# EAGLE schematic shieldV4 (EAGLE 8.7.1)

## Sheet 1 of 6
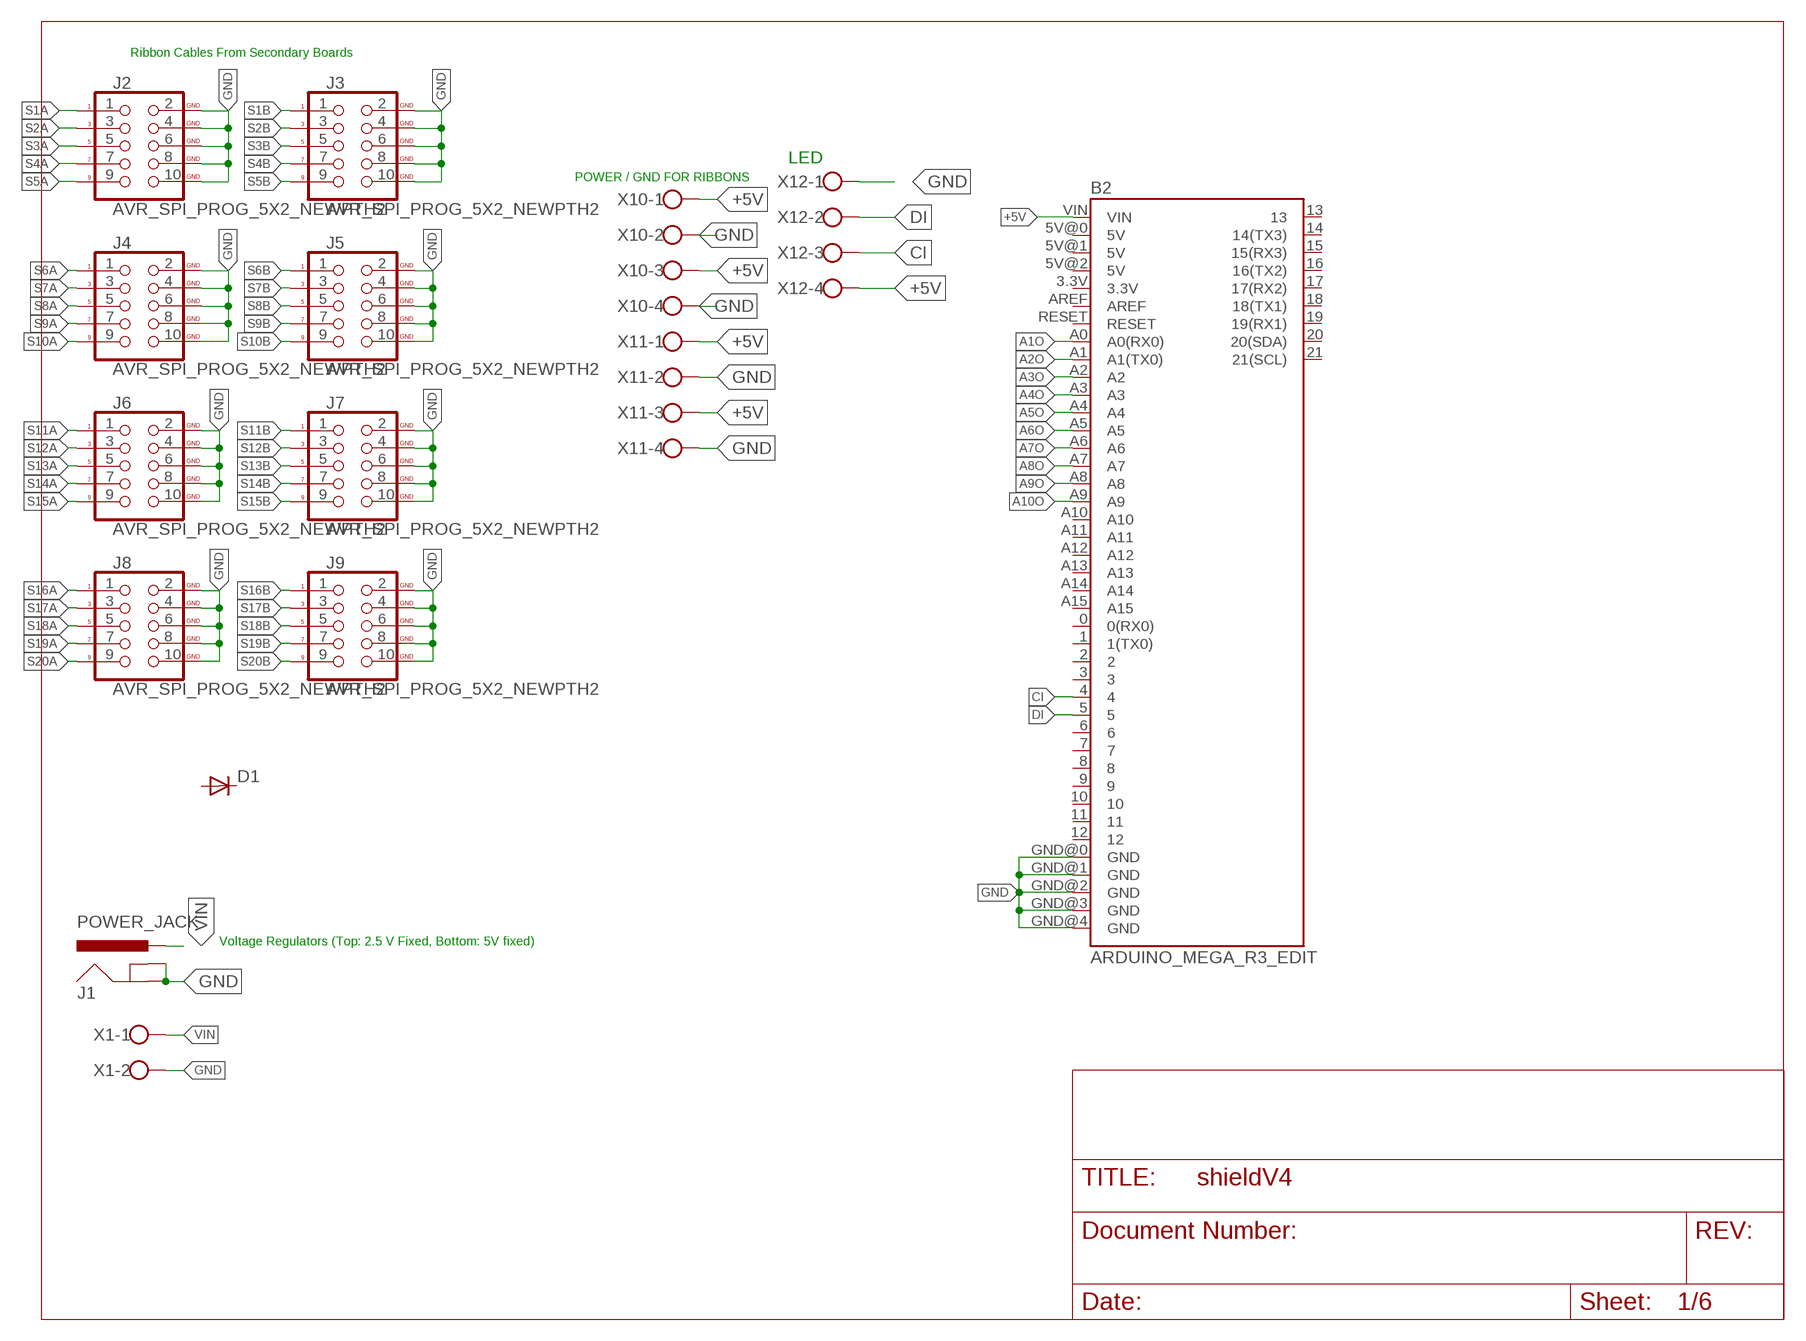
[diagram p0: schematic, sheet 1, part 1 of 2]
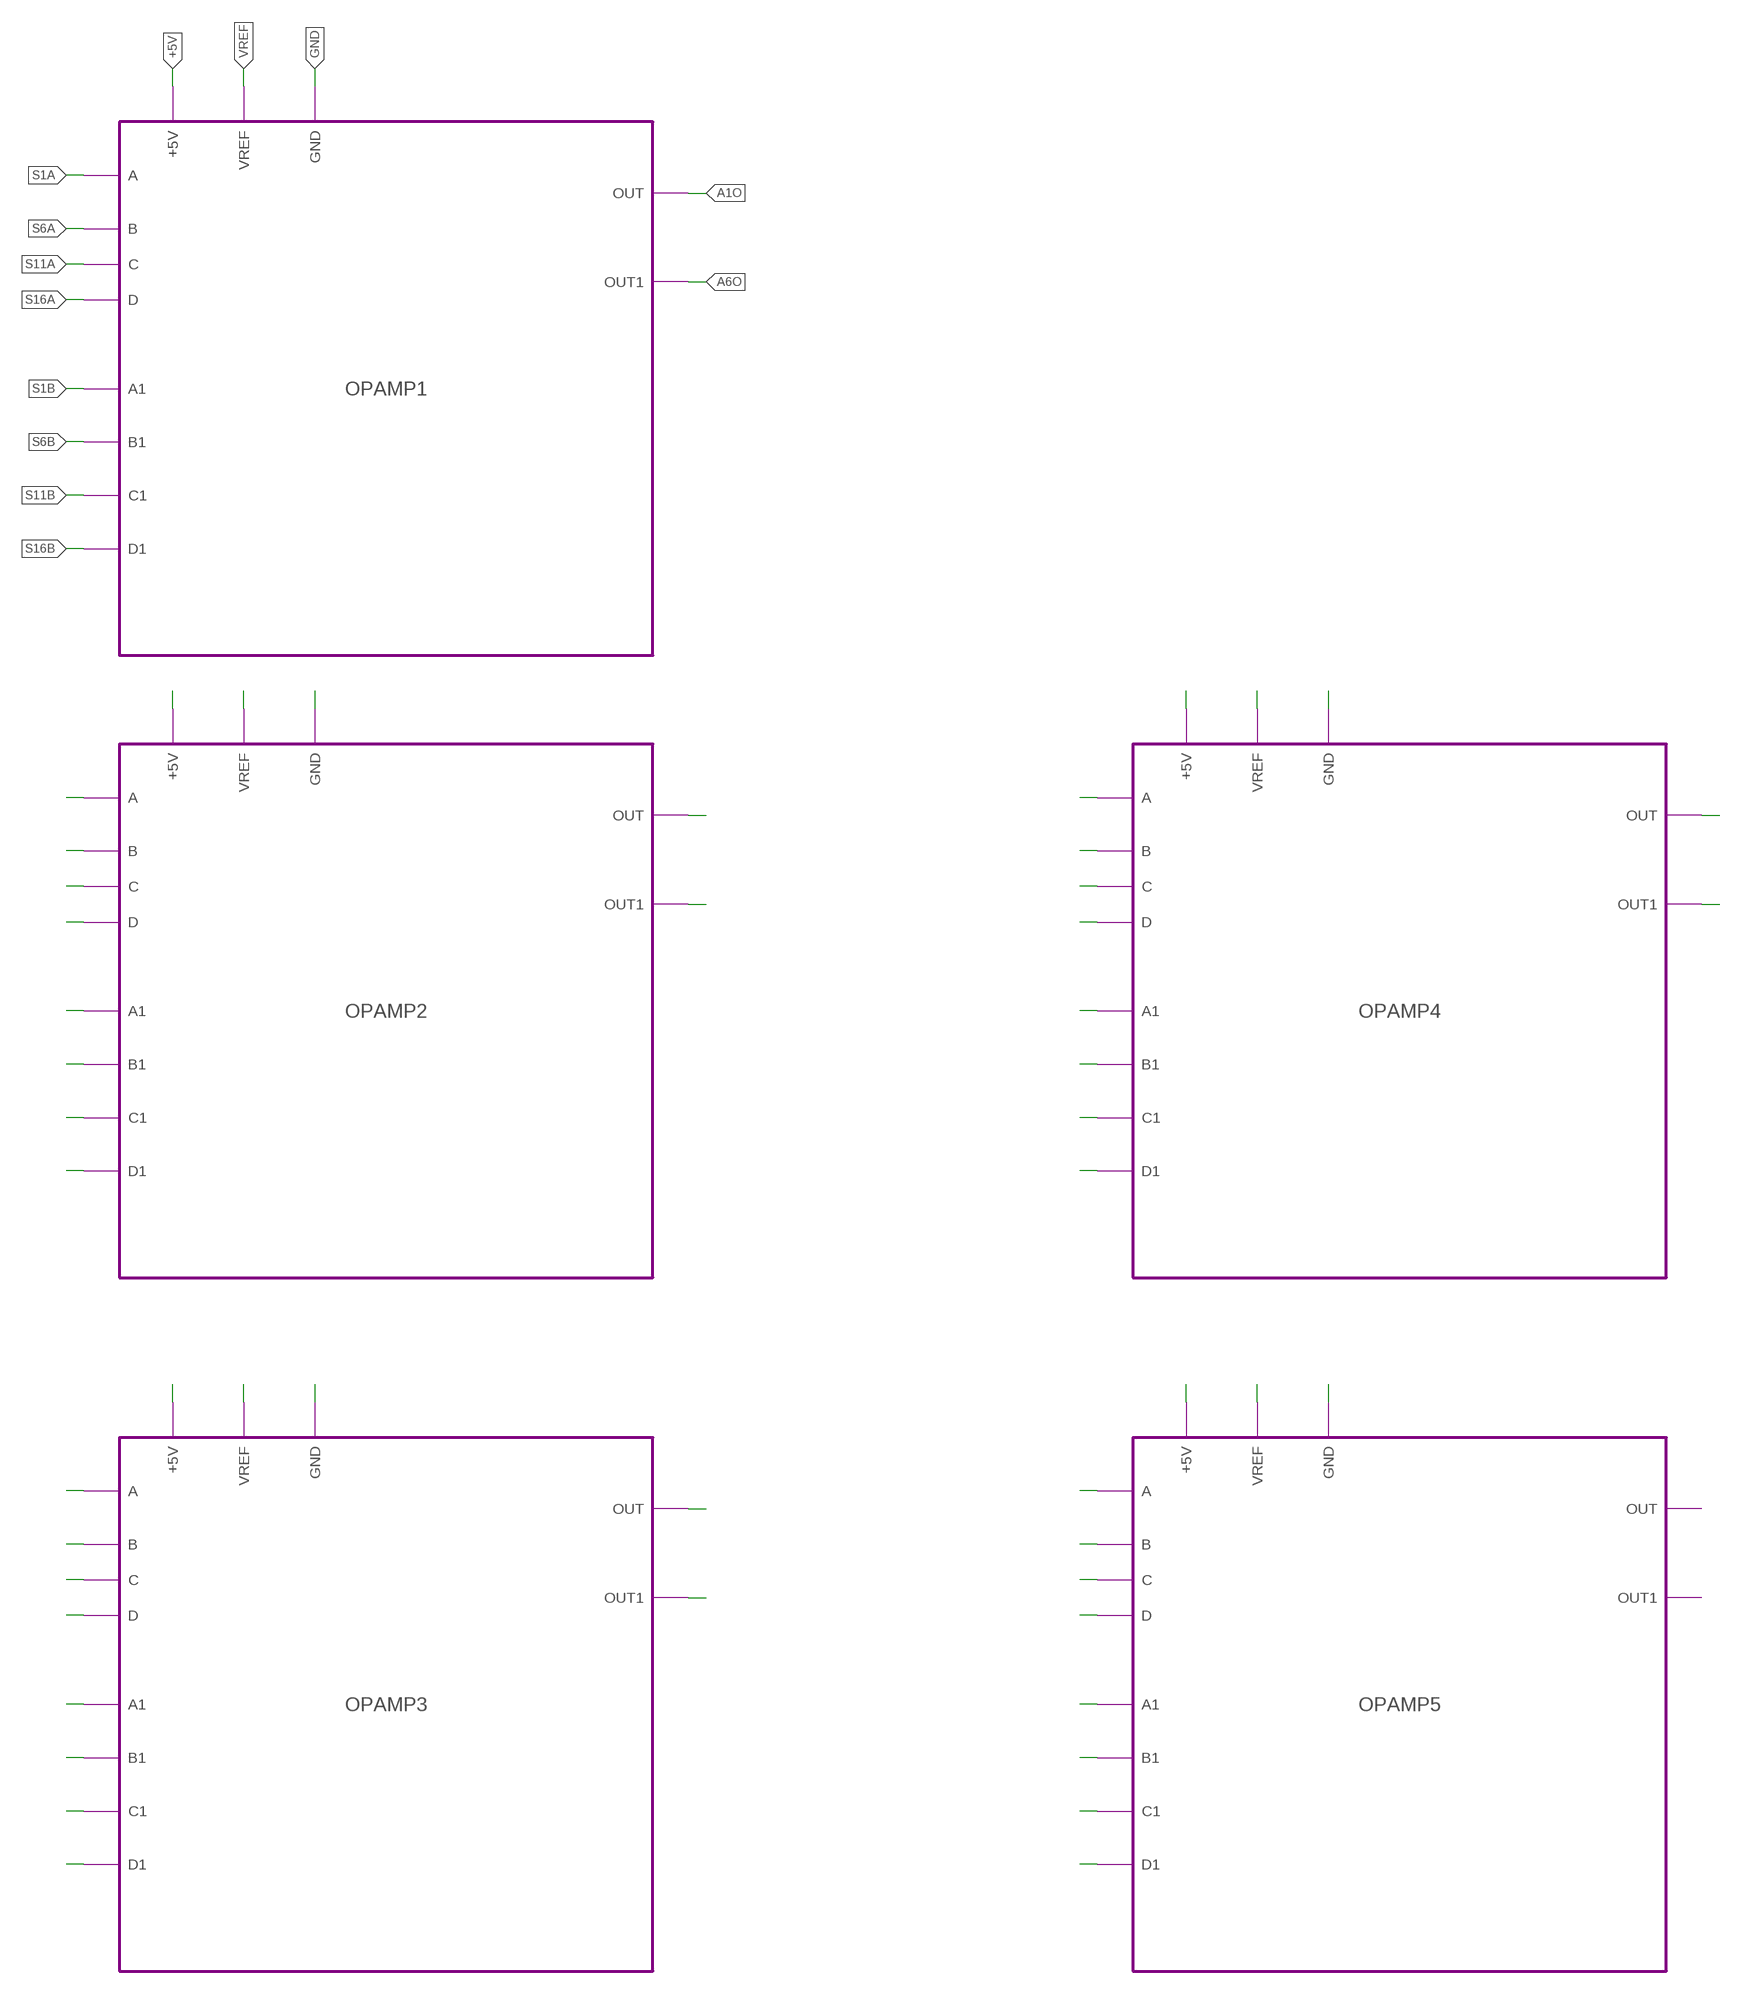
[diagram p1: schematic, sheet 1, part 2 of 2]

### Parts
B2  ARDUINO_MEGA_R3_EDIT  [ARDUINO_MEGA_EDIT]
D1  DIODE-DO-214AC  [DO-214AC]
J1  POWER_JACK  [POWER_JACK_PTH]
J2  AVR_SPI_PROG_5X2_NEWPTH2  [2X5-SHROUDED]
J3  AVR_SPI_PROG_5X2_NEWPTH2  [2X5-SHROUDED]
J4  AVR_SPI_PROG_5X2_NEWPTH2  [2X5-SHROUDED]
J5  AVR_SPI_PROG_5X2_NEWPTH2  [2X5-SHROUDED]
J6  AVR_SPI_PROG_5X2_NEWPTH2  [2X5-SHROUDED]
J7  AVR_SPI_PROG_5X2_NEWPTH2  [2X5-SHROUDED]
J8  AVR_SPI_PROG_5X2_NEWPTH2  [2X5-SHROUDED]
J9  AVR_SPI_PROG_5X2_NEWPTH2  [2X5-SHROUDED]
X1  W237-102  [W237-102]
X10  W237-4  [W237-4]
X11  W237-4  [W237-4]
X12  W237-4  [W237-4]

### Module instances
OPAMP1 = OPAMP
OPAMP2 = OPAMP
OPAMP3 = OPAMP
OPAMP4 = OPAMP
OPAMP5 = OPAMP

### Nets
+5V: B2.VIN X10.1 X10.3 X11.1 X11.3 X12.4 ; port OPAMP1.+5V
A1O: B2.A0(A0(RX0)) ; port OPAMP1.OUT
A2O: B2.A1(A1(TX0))
A3O: B2.A2
A4O: B2.A3
A5O: B2.A4
A6O: B2.A5 ; port OPAMP1.OUT1
A7O: B2.A6
A8O: B2.A7
A9O: B2.A8
A10O: B2.A9
CI: B2.4 X12.3
DI: B2.5 X12.2
GND: B2.GND@0(GND) B2.GND@1(GND) B2.GND@2(GND) B2.GND@3(GND) B2.GND@4(GND) J1.GND J1.GNDBREAK J2.2(GND) J2.4(GND) J2.6(GND) J2.8(GND) J2.10(GND) J3.2(GND) J3.4(GND) J3.6(GND) J3.8(GND) J3.10(GND) J4.2(GND) J4.4(GND) J4.6(GND) J4.8(GND) J4.10(GND) J5.2(GND) J5.4(GND) J5.6(GND) J5.8(GND) J5.10(GND) J6.2(GND) J6.4(GND) J6.6(GND) J6.8(GND) J6.10(GND) J7.2(GND) J7.4(GND) J7.6(GND) J7.8(GND) J7.10(GND) J8.2(GND) J8.4(GND) J8.6(GND) J8.8(GND) J8.10(GND) J9.2(GND) J9.4(GND) J9.6(GND) J9.8(GND) J9.10(GND) X1.2 X10.2 X10.4 X11.2 X11.4 X12.1 ; port OPAMP1.GND
N$14: port OPAMP2.A
N$15: port OPAMP2.B
N$16: port OPAMP2.C
N$17: port OPAMP2.D
N$18: port OPAMP2.A1
N$19: port OPAMP2.B1
N$20: port OPAMP2.C1
N$21: port OPAMP2.D1
N$22: port OPAMP2.+5V
N$23: port OPAMP2.VREF
N$24: port OPAMP2.GND
N$25: port OPAMP2.OUT
N$26: port OPAMP2.OUT1
N$27: port OPAMP3.A
N$28: port OPAMP3.B
N$29: port OPAMP3.C
N$30: port OPAMP3.D
N$31: port OPAMP3.A1
N$32: port OPAMP3.B1
N$33: port OPAMP3.C1
N$34: port OPAMP3.D1
N$35: port OPAMP3.+5V
N$36: port OPAMP3.VREF
N$37: port OPAMP3.GND
N$38: port OPAMP3.OUT
N$39: port OPAMP3.OUT1
N$40: port OPAMP4.A
N$41: port OPAMP4.B
N$42: port OPAMP4.C
N$43: port OPAMP4.D
N$44: port OPAMP4.A1
N$45: port OPAMP4.B1
N$46: port OPAMP4.C1
N$47: port OPAMP4.D1
N$48: port OPAMP4.+5V
N$49: port OPAMP4.VREF
N$50: port OPAMP4.GND
N$51: port OPAMP4.OUT
N$52: port OPAMP4.OUT1
N$53: port OPAMP5.A
N$54: port OPAMP5.B
N$55: port OPAMP5.C
N$56: port OPAMP5.D
N$57: port OPAMP5.A1
N$58: port OPAMP5.B1
N$59: port OPAMP5.C1
N$60: port OPAMP5.D1
N$61: port OPAMP5.+5V
N$62: port OPAMP5.VREF
N$63: port OPAMP5.GND
N$64: port OPAMP5.OUT ; also sheet 6
N$65: port OPAMP5.OUT1 ; also sheet 6
S1A: J2.1 ; port OPAMP1.A
S1B: J3.1 ; port OPAMP1.A1
S2A: J2.3
S2B: J3.3
S3A: J2.5
S3B: J3.5
S4A: J2.7
S4B: J3.7
S5A: J2.9
S5B: J3.9
S6A: J4.1 ; port OPAMP1.B
S6B: J5.1 ; port OPAMP1.B1
S7A: J4.3
S7B: J5.3
S8A: J4.5
S8B: J5.5
S9A: J4.7
S9B: J5.7
S10A: J4.9
S10B: J5.9
S11A: J6.1 ; port OPAMP1.C
S11B: J7.1 ; port OPAMP1.C1
S12A: J6.3
S12B: J7.3
S13A: J6.5
S13B: J7.5
S14A: J6.7
S14B: J7.7
S15A: J6.9
S15B: J7.9
S16A: J8.1 ; port OPAMP1.D
S16B: J9.1 ; port OPAMP1.D1
S17A: J8.3
S17B: J9.3
S18A: J8.5
S18B: J9.5
S19A: J8.7
S19B: J9.7
S20A: J8.9
S20B: J9.9
VIN: J1.PWR X1.1
VREF: port OPAMP1.VREF
Unconnected: B2.0(0(RX0)) B2.1(1(TX0)) B2.2 B2.3 B2.3.3V B2.5V@0(5V) B2.5V@1(5V) B2.5V@2(5V) B2.6 B2.7 B2.8 B2.9 B2.10 B2.11 B2.12 B2.13 B2.14(14(TX3)) B2.15(15(RX3)) B2.16(16(TX2)) B2.17(17(RX2)) B2.18(18(TX1)) B2.19(19(RX1)) B2.20(20(SDA)) B2.21(21(SCL)) B2.A10 B2.A11 B2.A12 B2.A13 B2.A14 B2.A15 B2.AREF B2.RESET D1.A D1.C

### Notes on the sheet
- Ribbon Cables From Secondary Boards
- LED
- POWER / GND FOR RIBBONS
- Voltage Regulators (Top: 2.5 V Fixed, Bottom: 5V fixed)

## Sheet 2 of 6

## Sheet 3 of 6

## Sheet 4 of 6

## Sheet 5 of 6

## Sheet 6 of 6
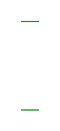
[diagram p2: schematic, sheet 6]

## Library data of the parts
B2 = SparkFun-Boards:ARDUINO_MEGA_R3_EDIT: Arduino Mega R3 ATmega2560 R3 compatible footprint. SparkFun Products: Arduino Mega 2560 R3 <https://www.sparkfun.com/products/11061>
D1 = diode:DIODE-: DIODE
J1 = SparkFun-Connectors:POWER_JACK: Power Jack Connector This is the standard 5.5mm barrel jack for power. The PTH is the most common, proven, reliable, footprint. The Slot footprint only works if the mill layer is transmitted to the PCB fab house so be warned. Here are the connectors we sell at SparkFun: DC Barrel Power Jack/Connector <https://www.sparkfun.com/products/119> (PRT-00119) DC Barrel Power Jack/Connector (SMD) <https://www.sparkfun.com/products/12748> (PRT-12748) DC Barrel Jack Adapter - Breadboard Compatible <https://www.sparkfun.com/products/10811> (PRT-10811) It is used on this SparkFun product (and many, many others): SparkFun RedBoard - Programmed with Arduino <https://www.sparkfun.com/products/12757> (DEV-12757) Also, if you need a mating power supply or connector, please check these out: Wall Adapter Power Supply - 9VDC 650mA <https://www.sparkfun.com/products/298> (TOL-00298) DC Barrel Jack Adapter - Male <https://www.sparkfun.com/products/10287> (PRT-10287); PROD_ID: CONN-08197
J2-J9 = SparkFun-Connectors:AVR_SPI_PROG_5X2_NEW: AVR 10-pin ICSP Header This is the standard AVR In Circuit Serial Programming header. Minimal, but includes pin one indicator. Works with standard Olimex programmers. SparkFun Products: 2x5 AVR ICSP Male Header <https://www.sparkfun.com/products/778> - PTH 2x5 Pin Shrouded Header <https://www.sparkfun.com/products/8506> - PTH2; PROD_ID: CONN-08671; SF_ID: PRT-08506
X1 = con-wago-500:W237-102: WAGO SCREW CLAMP; MPN: 237-102; OC_FARNELL: unknown; OC_NEWARK: 70K9898
X10-X12 = con-wago-500:W237-4: WAGO SCREW CLAMP; OC_FARNELL: unknown; OC_NEWARK: unknown

## Module OPAMP
Ports: A(in) B(in) C(in) D(in) A1(in) B1(in) C1(in) D1(in) +5V(pwr) VREF(pwr) GND(pwr) OUT(out) OUT1(out)
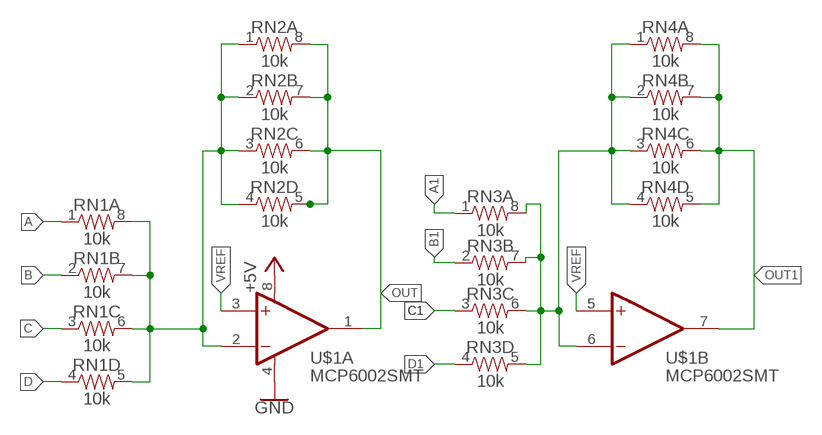
[diagram p3: schematic, module OPAMP, sheet 1]

### Parts
RN1  10k  1KOHM-ARRAY(4)0805-ARV-EDIT10K  [0805-ARV_EDIT10K]
RN2  10k  1KOHM-ARRAY(4)0805-ARV-EDIT10K  [0805-ARV_EDIT10K]
RN3  10k  1KOHM-ARRAY(4)0805-ARV-EDIT10K  [0805-ARV_EDIT10K]
RN4  10k  1KOHM-ARRAY(4)0805-ARV-EDIT10K  [0805-ARV_EDIT10K]
U$1  MCP6002SMT  [SOIC8]

### Nets
+5V: U$1.8(A:V+)
A: RN1.1
A1: RN3.1
B: RN1.2
B1: RN3.2
C: RN1.3
C1: RN3.3
D: RN1.4
D1: RN3.4
GND: U$1.4(A:V-)
N$1: RN3.5 RN3.6 RN3.7 RN3.8 RN4.1 RN4.2 RN4.3 RN4.4 U$1.6(B:-IN)
N$2: RN1.5 RN1.6 RN1.7 RN1.8 RN2.1 RN2.2 RN2.3 RN2.4 U$1.2(A:-IN)
OUT: RN2.5 RN2.6 RN2.7 RN2.8 U$1.1(A:OUT)
OUT1: RN4.5 RN4.6 RN4.7 RN4.8 U$1.7(B:OUT)
VREF: U$1.3(A:+IN) U$1.5(B:+IN)

### Library data of the parts
RN1-RN4 = SparkFun-Resistors:1KOHM-ARRAY(4): 4 x 1kΩ resistor array A resistor is a passive two-terminal electrical component that implements electrical resistance as a circuit element. Resistors act to reduce current flow, and, at the same time, act to lower voltage levels within circuits. - Wikipedia An array is a collection of discrete resistors in a single package.
U$1 = adam - ics:MCP6002: Dual General Op Amp 1.8V min supply 1MHz (6V/us)